# EAGLE design ADXL_eth_con (EAGLE 9.6.2)
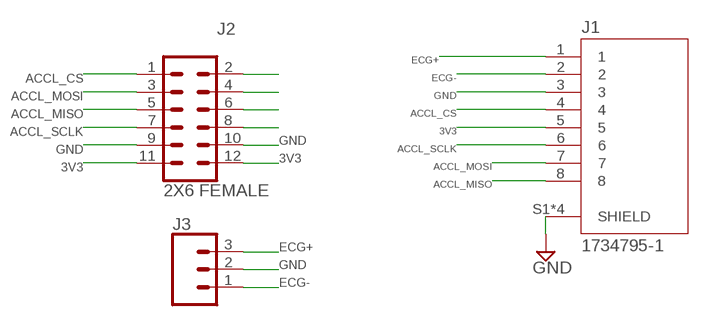
[diagram p0: schematic, sheet 1]

## Parts
J1  1734795-1  [TE_1734795-1]
J2  2X6 FEMALE  CONN_06X2PTH_FEMALE  [2X6]
J3  CONN_03  [1X03]

## Nets
3V3: J1.5 J2.11 J2.12
ACCL_CS: J1.4 J2.1
ACCL_MISO: J1.8 J2.5
ACCL_MOSI: J1.7 J2.3
ACCL_SCLK: J1.6 J2.7
ECG+: J1.1 J3.3
ECG-: J1.2 J3.1
GND: J1.3 J1.S1(SHIELD) J1.S2(SHIELD) J1.S3(SHIELD) J1.S4(SHIELD) J2.9 J2.10 J3.2
N$7: J2.2
N$8: J2.4
N$9: J2.6
N$10: J2.8

## Library data of the parts
J1 = SamacSys_Parts:1734795-1: RJ45,8P8C,SHD,W/O LED,DIP 6u" Check prices <https://pricing.snapeda.com/parts/1734795-1/TE%20Connectivity/view-part?ref=eda>; AVAILABILITY: In Stock; CENTERLINE_PITCH: 1.02 mm[.04 in]; COMMENT: 1734795-1; DESCRIPTION: RJ45,8P8C,SHD,W/O LED,DIP 6u; EU_ROHS_COMPLIANCE: Compliant; MF: TE Connectivity; MP: 1734795-1; NUMBER_OF_POSITIONS: 8; PACKAGE: None; PRICE: None; PURCHASE-URL: https://pricing.snapeda.com/search/part/1734795-1/?ref=eda
J2 = SparkFun-Connectors:CONN_06X2: Multi connection point. Often used as Generic Header-pin footprint for 0.1 inch spaced/style header connections On any of the 0.1 inch spaced packages, you can populate with these: Break Away Headers - Straight <https://www.sparkfun.com/products/116> (PRT-00116) Break Away Male Headers - Right Angle <https://www.sparkfun.com/products/553> (PRT-00553) Female Headers <https://www.sparkfun.com/products/115> (PRT-00115) Break Away Headers - Machine Pin <https://www.sparkfun.com/products/117> (PRT-00117) Break Away Female Headers - Swiss Machine Pin <https://www.sparkfun.com/products/743> (PRT-00743); PROD_ID: CONN-12423
J3 = SparkFun-Connectors_edited:CONN_03: Multi connection point. Often used as Generic Header-pin footprint for 0.1 inch spaced/style header connections On any of the 0.1 inch spaced packages, you can populate with these: Break Away Headers - Straight <https://www.sparkfun.com/products/116> (PRT-00116) Break Away Male Headers - Right Angle <https://www.sparkfun.com/products/553> (PRT-00553) Female Headers <https://www.sparkfun.com/products/115> (PRT-00115) Break Away Headers - Machine Pin <https://www.sparkfun.com/products/117> (PRT-00117) Break Away Female Headers - Swiss Machine Pin <https://www.sparkfun.com/products/743> (PRT-00743) Stackable Header - 3 Pin (Female, 0.1") <https://www.sparkfun.com/products/13875> (PRT-13875) For SCREWTERMINALS and SPRING TERMINALS visit here: Screw Terimnals on SparkFun.com <https://www.sparkfun.com/search/results?term=Screw+Terminals> (5mm/3.5mm/2.54mm spacing) This device is also useful as a general connection point to wire up your design to another part of your project. Our various solder wires solder well into these plated through hole pads. Hook-Up Wire - Assortment (Stranded, 22 AWG) <https://www.sparkfun.com/products/11375> (PRT-11375) Hook-Up Wire - Assortment (Solid Core, 22 AWG) <https://www.sparkfun.com/products/11367> (PRT-11367) View the entire wire category on our website here <https://www.sparkfun.com/categories/141> Special notes: Molex polarized connector foot print use with SKU : PRT-08232 with associated crimp pins and housings.

## Board
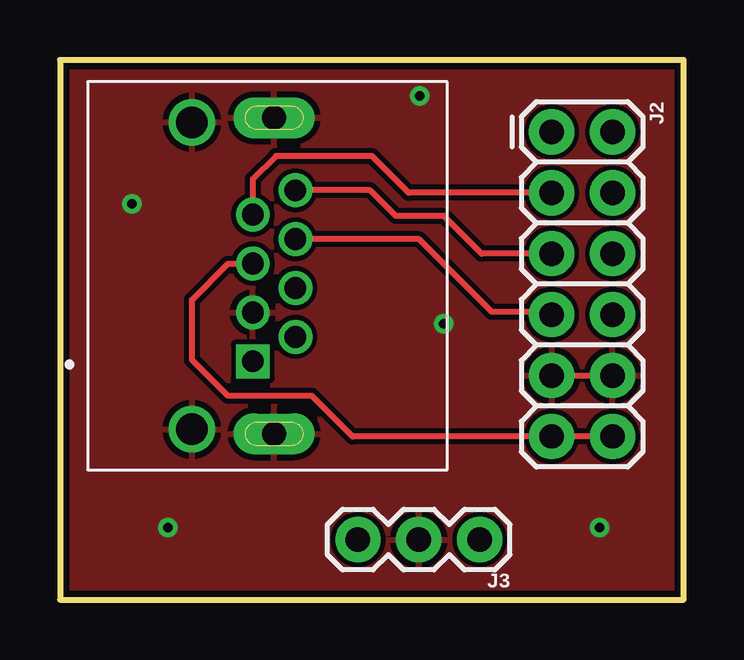
[diagram p1: board, top side]
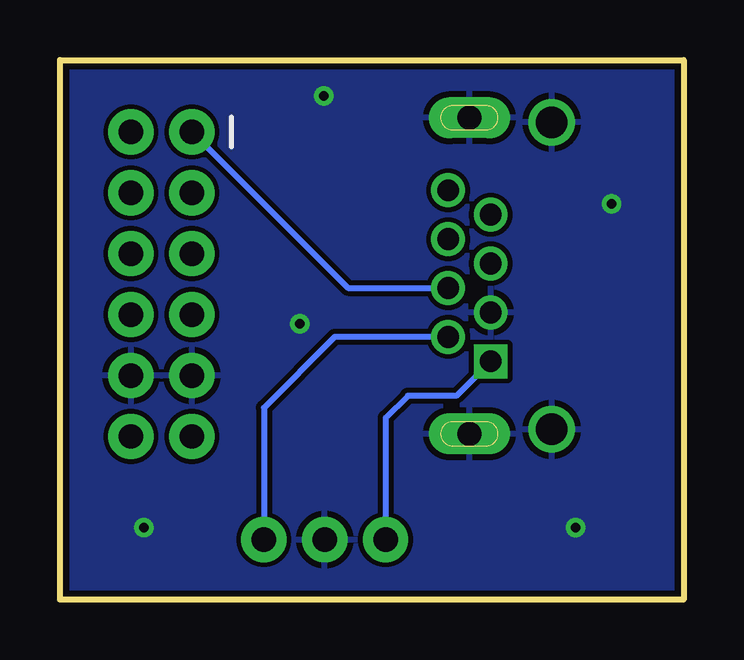
[diagram p2: board, bottom side, seen from below]

Size 26 x 22.5 mm. Coordinates in mm from the lower left corner, seen from the top.
Outline: 0,22.5 0,0 26,0 26,22.5 0,22.5
Copper layers (1*16): Top 0.035mm / dielectric 1.5mm / Bottom 0.035mm
Design rules "adafruit": minimum track width 8mil, minimum drill 15.5mil, track to track 8mil, track to pad 8mil, pad to pad 8mil, via to via 8mil, smd to smd 8mil, copper to edge 10mil, drill to drill 8mil, minimum pad ring 10mil, minimum via ring 8mil, stop-mask expansion 2mil, vias tented up to drill 20mil, thermal gap 10mil

### Footprints (pad centres in the part's own frame; a part is rotated, then mirrored left to right if it is on the bottom)
TE_1734795-1 = drill 0.9 square: 1 3.57,2.54 | drill 0.9: 2 2.55,4.32; 3 1.53,2.54; 4 0.51,4.32; 5 -0.51,2.54; 6 -1.53,4.32; 7 -2.55,2.54; 8 -3.57,4.32 | drill 1 pad 1.7 long: S1 -6.59,3.43; S2 6.59,3.43 | drill 1.3: S3 -6.4,0; S4 6.4,0
2X6 = drill 1.016 pad 1.88: 1 0,0; 2 0,2.54; 3 2.54,0; 4 2.54,2.54; 5 5.08,0; 6 5.08,2.54; 7 7.62,0; 8 7.62,2.54; 9 10.16,0; 10 10.16,2.54; 11 12.7,0; 12 12.7,2.54
1X03 = drill 1.016 pad 1.88: 1 0,0; 2 2.54,0; 3 5.08,0

### Placement (x,y rotation side)
J1  5.5,13.5 270 top
J2  20.5,19.5 270 top
J3  17.5,2.5 180 top

### Tracks (layer width: path | path; a pad name or v marks a point on that pad's centre or on a via)
3V3
  Top 0.254: J2.11 20,6.8 | 20,6.8 12.2,6.8 10.5,8.5 7,8.5 5.5,10 5.5,12.5 7.01,14.01 J1.5 | J2.12 20,6.8
ACCL_CS
  Bottom 0.254: J2.1 13.99,12.99 J1.4
ACCL_MISO
  Top 0.254: J2.5 17.58,14.42 16,16 14,16 12.93,17.07 J1.8
ACCL_MOSI
  Top 0.254: J2.3 14.54,16.96 13,18.5 9,18.5 8.04,17.54 J1.7
ACCL_SCLK
  Top 0.254: J2.7 20.38,12 18,12 14.97,15.03 J1.6
ECG+
  Bottom 0.254: J1.1 9.47,8.5 11.5,8.5 12.42,7.58 J3.3
ECG-
  Bottom 0.254: J1.2 14.55,10.95 17.5,8 J3.1
GND  (via drill 0.39)
  Top 0.254: J2.9 J2.10
  other vias: 3,16.5 4.5,3 22.5,3 16,11.5 15,21
  pour Top: -3,24.5 -3,-4 28.5,-4 29.5,-3 29.5,26 29,26.5 -0.5,26.5
  pour Bottom: -1.5,25 -1.5,-4 26.5,-4 29,-1.5 29,22 26.5,24.5 26,25